# EAGLE design Launch_Tower_Ignition_Board_v6-4 (EAGLE 6.4)
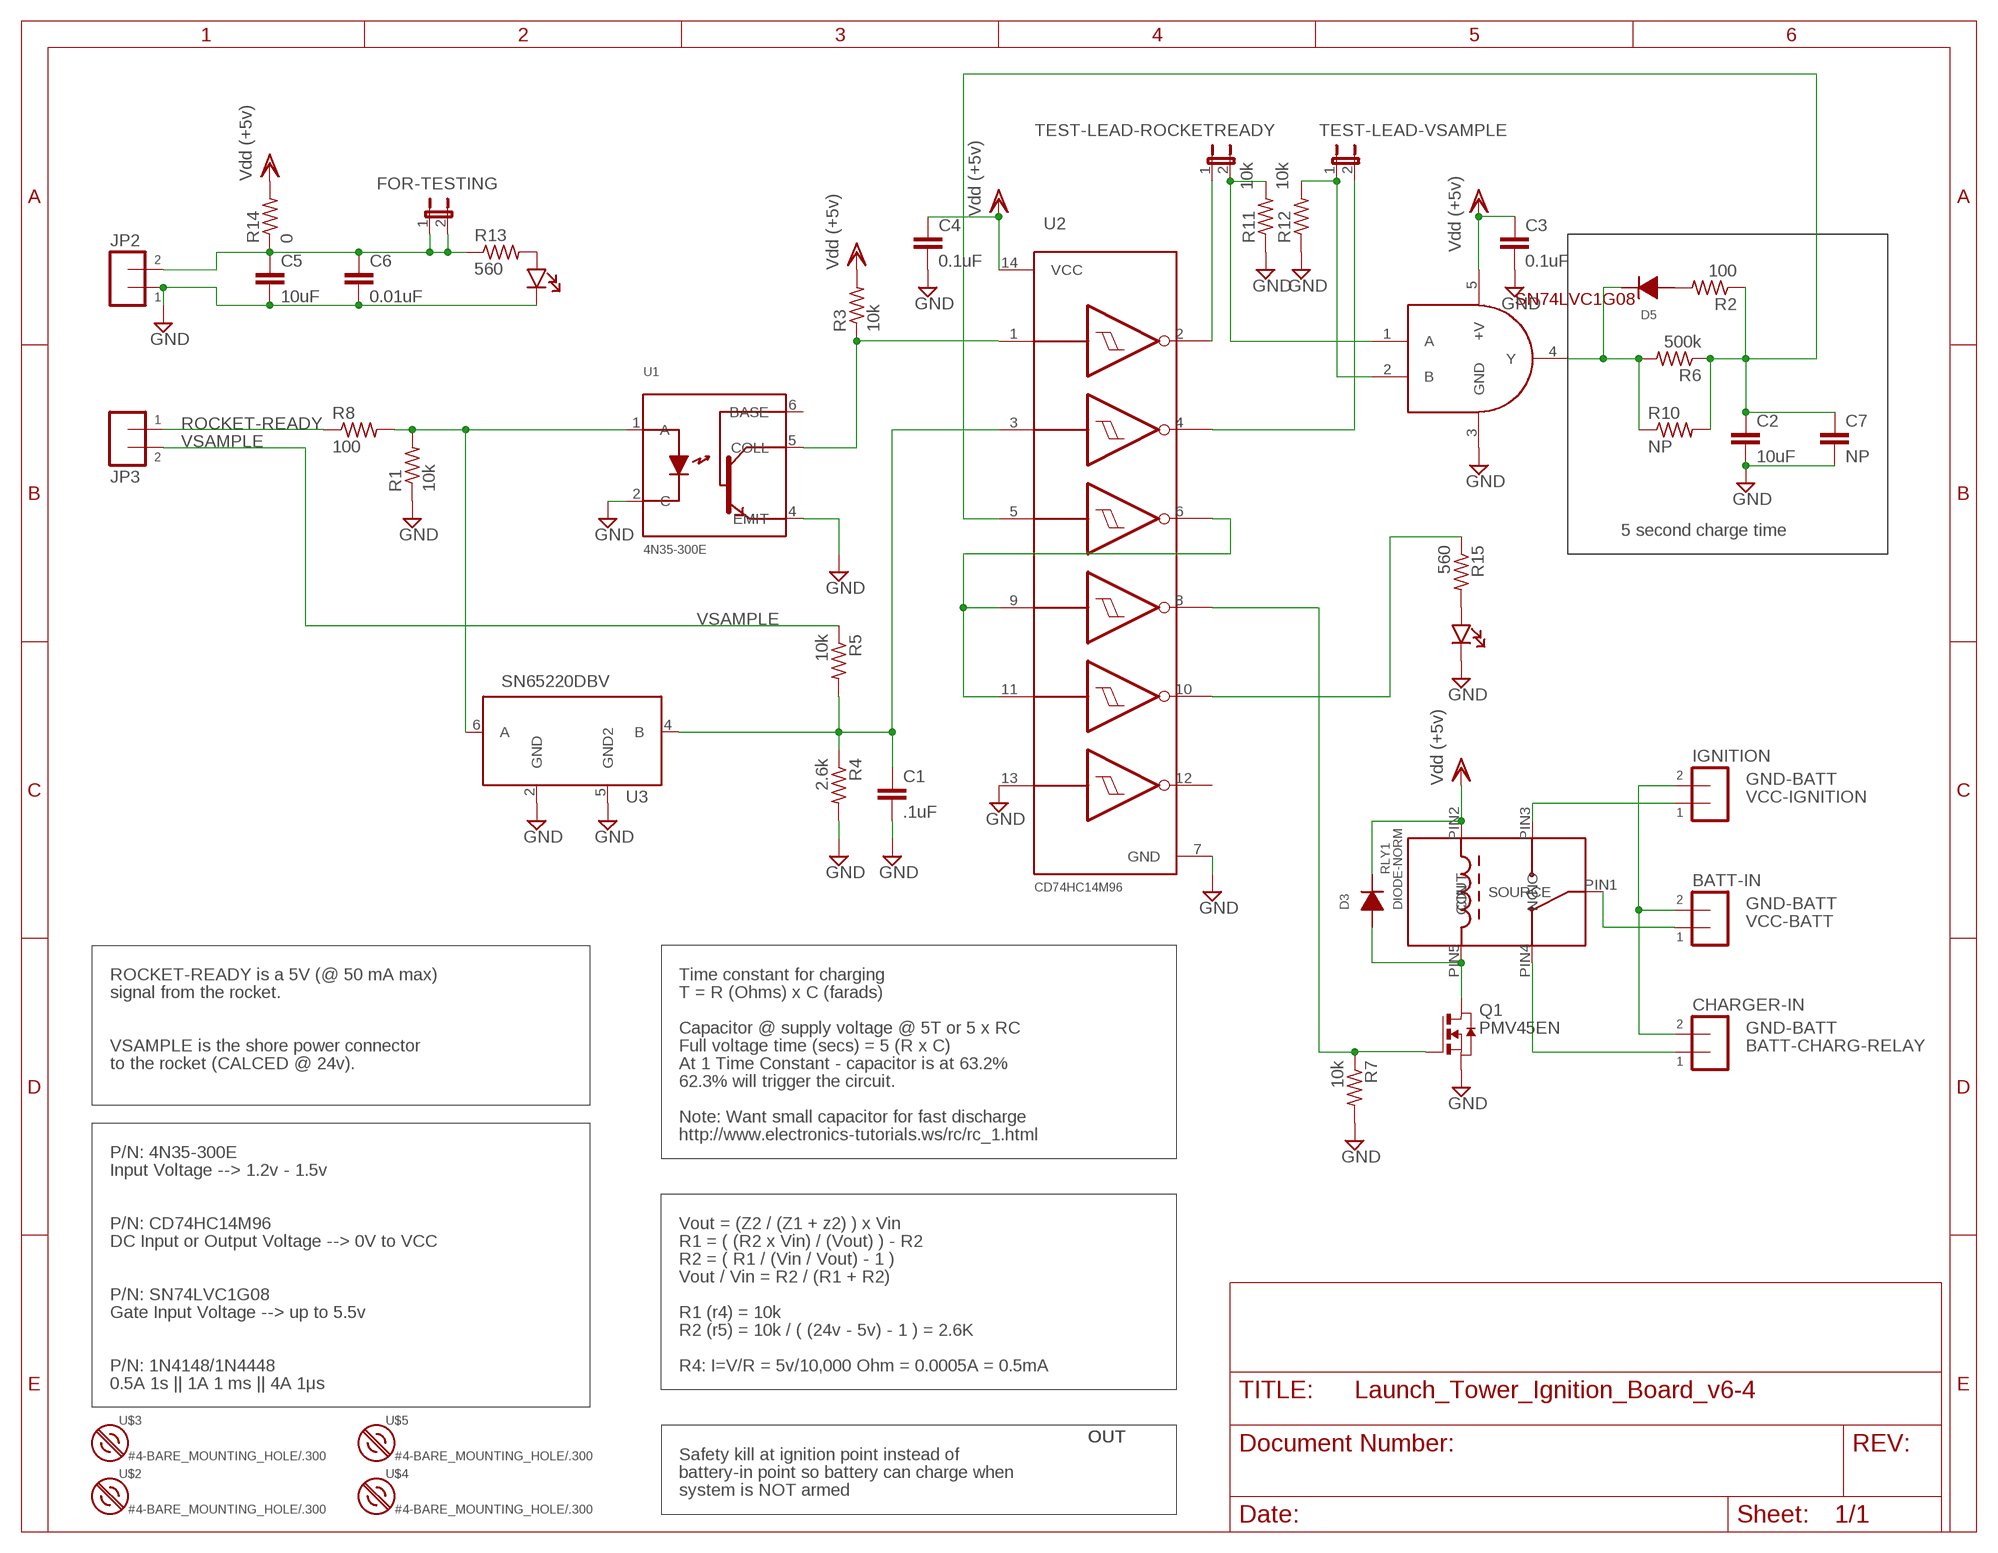
[diagram p0: schematic, sheet 1]

## Parts
BATT-IN  SCREW-TERMINAL-5MM  [SCREW-TERM-5MM]
C1  .1uF  C-EU0805-B  [0805-B]
C2  10uF  C-EU0805-B  [0805-B]
C3  0.1uF  C-EU0805-B  [0805-B]
C4  0.1uF  C-EU0805-B  [0805-B]
C5  10uF  C-EU0805-B  [0805-B]
C6  0.01uF  C-EU0805-B  [0805-B]
C7  NP  CAPPTH  [CAP-PTH-SMALL]
CHARGER-IN  SCREW-TERMINAL-5MM  [SCREW-TERM-5MM]
D3  DIODE-NORM  [DIODE]
D5  DIODE-NORM  [DIODE]
FOR-TESTING  JUMPER-2PTH  [1X02]
IGNITION  SCREW-TERMINAL-5MM  [SCREW-TERM-5MM]
JP2  SCREW-TERMINAL-5MM  [SCREW-TERM-5MM]
JP3  SCREW-TERMINAL-5MM  [SCREW-TERM-5MM]
LED-POWER-INDICATOR  LED-550-XX04  [LED-550]
LED-POWER-INDICATOR1  LED-550-XX04  [LED-550]
Q1  PMV45EN  [SOT23]
R1  10k  R-US_0805-B  [0805-B]
R2  100  R-US_0805-B  [0805-B]
R3  10k  R-US_0805-B  [0805-B]
R4  2.6k  R-US_0805-B  [0805-B]
R5  10k  R-US_0805-B  [0805-B]
R6  500k  R-US_0805-B  [0805-B]
R7  10k  R-US_0805-B  [0805-B]
R8  100  R-US_0805-B  [0805-B]
R10  NP  R-US_0207/10  [0207/10]
R11  10k  R-US_0805-B  [0805-B]
R12  10k  R-US_0805-B  [0805-B]
R13  560  R-US_0805-B  [0805-B]
R14  0  R-US_0805-B  [0805-B]
R15  560  R-US_0805-B  [0805-B]
RLY1  RELAY-2  [G5LA]
TEST-LEAD-ROCKETREADY  JUMPER-2PTH  [1X02]
TEST-LEAD-VSAMPLE  JUMPER-2PTH  [1X02]
U1  OPTOISOLATOR  [4N35-300E]
U2  INVERT GATES  HEX_INV_SHMITT_TRIG  [INVERTSOIC14]
U3  SN65220DBV  [SOT23-6L]
U4  AND GATE  SN74LVC1G08  [SOT23-5]
U$2  #4-BARE_MOUNTING_HOLE/.300  [#4/.300-BARE+STD_NUT_OR_STAR_WASHER]
U$3  #4-BARE_MOUNTING_HOLE/.300  [#4/.300-BARE+STD_NUT_OR_STAR_WASHER]
U$4  #4-BARE_MOUNTING_HOLE/.300  [#4/.300-BARE+STD_NUT_OR_STAR_WASHER]
U$5  #4-BARE_MOUNTING_HOLE/.300  [#4/.300-BARE+STD_NUT_OR_STAR_WASHER]

## Nets
BATT-CHARG-RELAY: CHARGER-IN.1 RLY1.PIN4(NC)
GND-BATT: BATT-IN.2 CHARGER-IN.2 IGNITION.2
N$1: R12.2 TEST-LEAD-VSAMPLE.1 U4.2(B)
N$2: LED-POWER-INDICATOR.ANODE R13.2
N$3: R3.1 U1.5(COLL) U2.1(1A)
N$4: JP3.1 R8.1
N$5: R11.2 TEST-LEAD-ROCKETREADY.2 U4.1(A)
N$6: TEST-LEAD-VSAMPLE.2 U2.4(2Y)
N$7: C1.1 R4.1 R5.2 U2.3(2A) U3.4(B)
N$8: D5.A R2.2
N$9: D3.A Q1.3(D) RLY1.PIN5(CIN)
N$10: Q1.1(G) R7.1 U2.8(4Y)
N$11: TEST-LEAD-ROCKETREADY.1 U2.2(1Y)
N$12: C5.1 C6.1 FOR-TESTING.1 FOR-TESTING.2 JP2.2 R13.1 R14.1
N$13: D5.C R6.2 R10.1 U4.4(Y)
N$14: R15.1 U2.10(5Y)
N$15: C2.1 C7.1 R2.1 R6.1 R10.2 U2.5(3A)
N$18: LED-POWER-INDICATOR1.ANODE R15.2
N-NOT2: U2.6(3Y) U2.9(4A) U2.11(5A)
NAME: C1.2 C2.2 C3.2 C4.2 C5.2 C6.2 C7.2 JP2.1 LED-POWER-INDICATOR1.CATHODE LED-POWER-INDICATOR.CATHODE Q1.2(S) R1.1 R4.2 R7.2 R11.1 R12.1 U1.2(C) U1.4(EMIT) U2.7(GND) U2.13(6A) U3.2(GND) U3.5(GND2) U4.3(GND) ; supply symbol labelled GND
ROCKET-READY: R1.2 R8.2 U1.1(A) U3.6(A)
VCC-BATT: BATT-IN.1 RLY1.PIN1(SOURCE)
VCC-IGNITION: IGNITION.1 RLY1.PIN3(NO)
VDD: C3.1 C4.1 D3.C R3.2 R14.2 RLY1.PIN2(COUT) U2.14(VCC) U4.5(+V) ; supply symbol labelled Vdd (+5v)
VSAMPLE: JP3.2 R5.1
Unconnected: U1.6(BASE) U2.12(6Y)

## Notes on the sheet
- 5 second charge time
- ROCKET-READY is a 5V (@ 50 mA max) | Time constant for charging
- signal from the rocket. | T = R (Ohms) x C (farads)
- Capacitor @ supply voltage @ 5T or 5 x RC
- VSAMPLE is the shore power connector | Full voltage time (secs) = 5 (R x C)
- to the rocket (CALCED @ 24v). | At 1 Time Constant - capacitor is at 63.2%
- 62.3% will trigger the circuit.
- Note: Want small capacitor for fast discharge
- http://www.electronics-tutorials.ws/rc/rc_1.html
- P/N: 4N35-300E
- Input Voltage --> 1.2v - 1.5v
- P/N: CD74HC14M96 | Vout = (Z2 / (Z1 + z2) ) x Vin
- DC Input or Output Voltage --> 0V to VCC | R1 = ( (R2 x Vin) / (Vout) ) - R2
- R2 = ( R1 / (Vin / Vout) - 1 )
- Vout / Vin = R2 / (R1 + R2)
- P/N: SN74LVC1G08
- Gate Input Voltage --> up to 5.5v | R1 (r4) = 10k
- R2 (r5) = 10k / ( (24v - 5v) - 1 ) = 2.6K
- P/N: 1N4148/1N4448 | R4: I=V/R = 5v/10,000 Ohm = 0.0005A = 0.5mA
- 0.5A 1s || 1A 1 ms || 4A 1μs
- OUT | OUT | OUT
- Safety kill at ignition point instead of
- battery-in point so battery can charge when
- system is NOT armed

## Library data of the parts
BATT-IN CHARGER-IN IGNITION JP2 JP3 = launch-tower:SCREW-TERMINAL-5MM
C1-C6 = rcl_custom:C-EU: CAPACITOR, European symbol
C7 = SparkFun:CAP: Capacitor Standard 0603 ceramic capacitor, and 0.1" leaded capacitor.
D3 D5 = launch-tower:DIODE-NORM
FOR-TESTING TEST-LEAD-ROCKETREADY TEST-LEAD-VSAMPLE = SparkFun:JUMPER-2: Jumper Basic 0.1" spaced jumper. Use with breakaway headers.
LED-POWER-INDICATOR LED-POWER-INDICATOR1 = launch-tower:LED-550-XX04
Q1 = Tova:PMV45EN
R1-R8 R10-R15 = rcl_custom:R-US_: RESISTOR, American symbol
RLY1 = launch-tower:RELAY-2
U1 = launch-tower:OPTOISOLATOR
U2 = launch-tower:HEX_INV_SHMITT_TRIG: Single Schmitt-Trigger Inverter Gate
U3 = sn65220:SN65220
U4 = SparkFun:SN74LVC1G08
U$2-U$5 = mount:#4-BARE_MOUNTING_HOLE: 1/8" drill hole for #4 screw mount

## Board
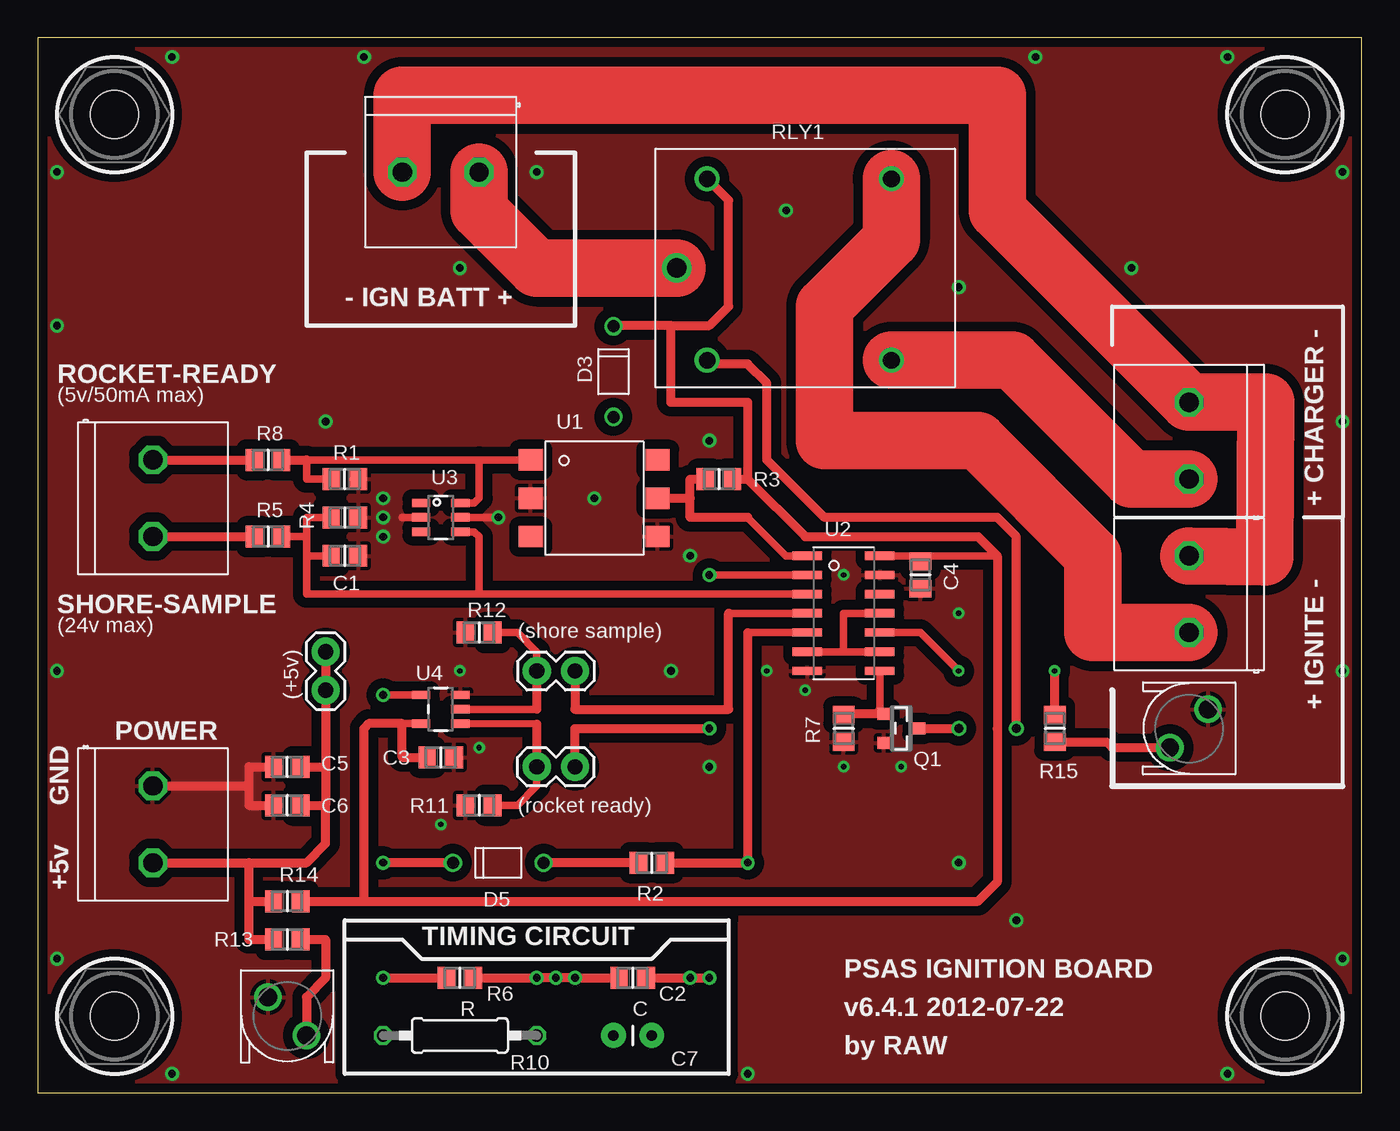
[diagram p1: board, top side]
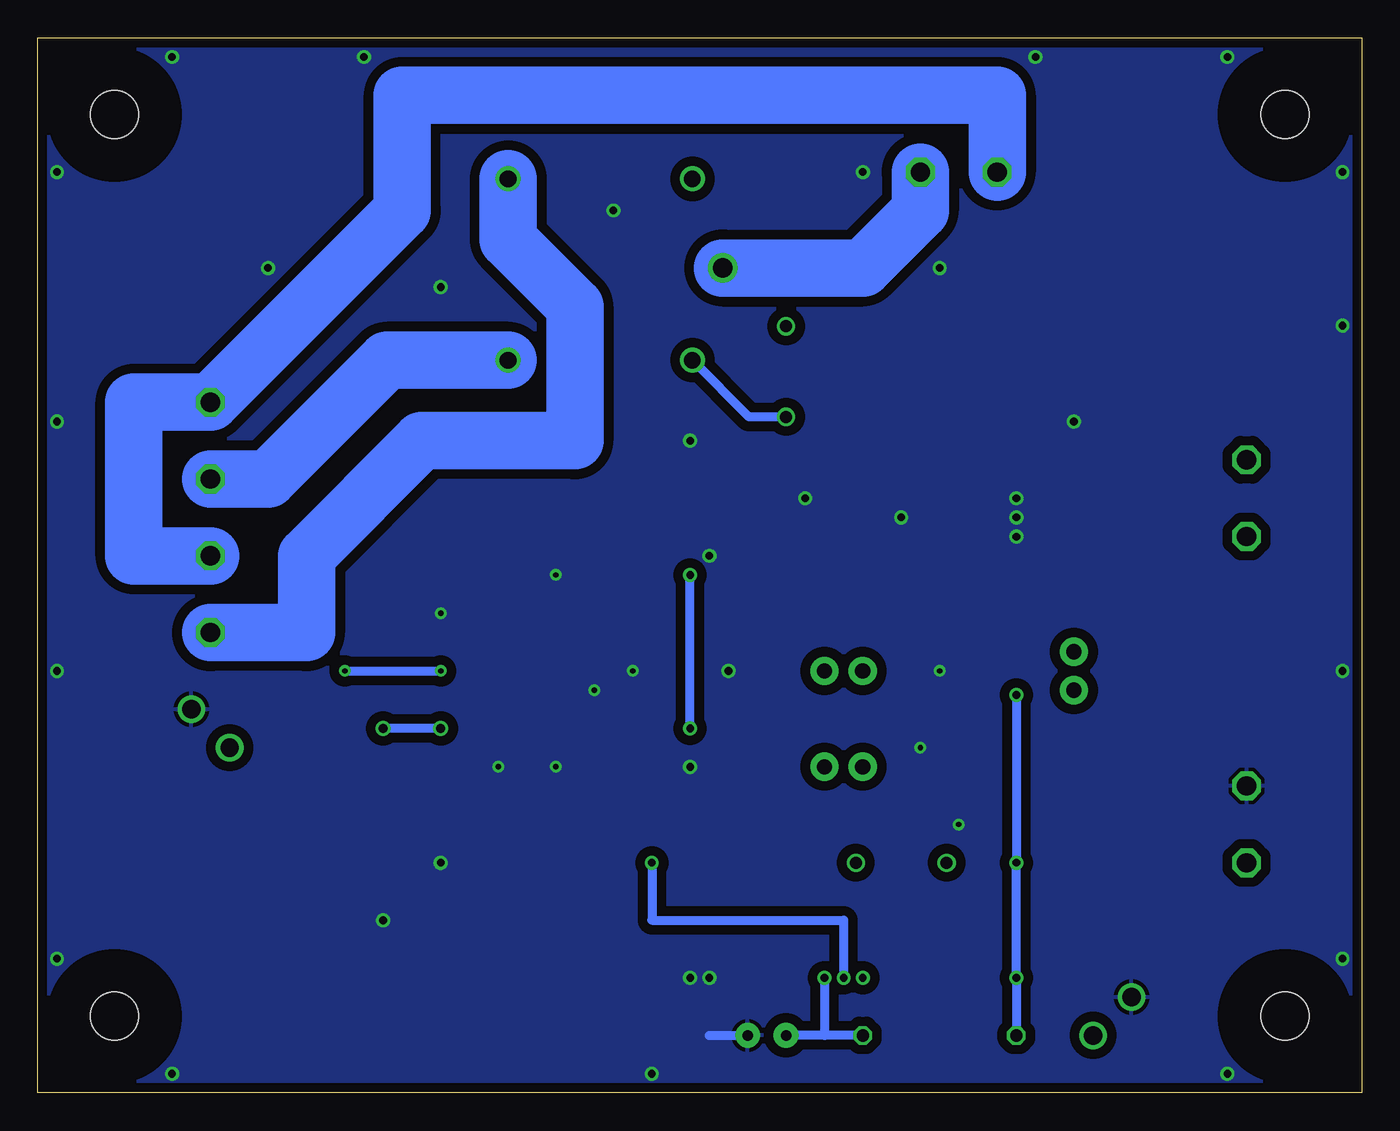
[diagram p2: board, bottom side, seen from below]

Size 87.63 x 69.85 mm. Coordinates in mm from the lower left corner, seen from the top.
Outline: 0,0 87.63,0 87.63,69.85 0,69.85 0,0
Copper layers (1*16): Top 0.0178mm / dielectric 59mil / Bottom 0.0178mm
Design rules "default": minimum track width 6mil, minimum drill 14mil, track to track 6mil, track to pad 6mil, pad to pad 6mil, via to via 6mil, smd to smd 6mil, copper to edge 20mil, drill to drill 16mil, minimum pad ring 8mil, minimum via ring 8mil, stop-mask expansion 3mil, vias tented up to drill 0mil, thermal gap 10mil
tRestrict: area 20.3,1.3 to 45.7,11.4

### Footprints (pad centres in the part's own frame; a part is rotated, then mirrored left to right if it is on the bottom)
SCREW-TERM-5MM = drill 1.27 octagon: 1 -2.54,0; 2 2.54,0
0805-B = smd 1.15 x 1.45: 1 -0.9,0; 2 0.9,0
CAP-PTH-SMALL = drill 0.7 pad 1.651: 1 0,0; 2 2.54,0
DIODE = drill 0.8: A 3,0; C -3,0
1X02 = drill 1.016 pad 1.88: 1 0,0; 2 2.54,0
LED-550 = drill 1.22: ANODE 1.27,-1.27; CATHODE -1.27,1.27
SOT23 = smd 0.787 x 0.889: 1 -0.953,-1.143; 2 0.953,-1.143; 3 0,1.143
0207/10 = drill 0.813 octagon: 1 -5.08,0; 2 5.08,0
G5LA = drill 1.3: PIN1 -8.5,0 | drill 1.1: PIN2 -6.5,5.9; PIN3 5.7,5.9; PIN4 5.7,-6.1; PIN5 -6.5,-6.1
4N35-300E = smd 1.4 x 1.6: 1 -2.54,-4.2; 2 0,-4.2; 3 2.54,-4.2; 4 2.54,4.2; 5 0,4.2; 6 -2.54,4.2
INVERTSOIC14 = smd 0.55 x 1.95: 1 -3.81,-2.4; 2 -2.54,-2.4; 3 -1.27,-2.4; 4 0,-2.4; 5 1.27,-2.4; 6 2.54,-2.4; 7 3.81,-2.4; 8 3.81,2.4; 9 2.54,2.4; 10 1.27,2.4; 11 0,2.4; 12 -1.27,2.4; 13 -2.54,2.4; 14 -3.81,2.4
SOT23-6L = smd 0.55 x 1.2: 1 -0.95,-1.3; 2 0,-1.3; 3 0.95,-1.3; 4 0.95,1.3; 5 0,1.3; 6 -0.95,1.3
SOT23-5 = smd 0.55 x 1.2: 1 -0.95,-1.3; 2 0,-1.3; 3 0.95,-1.3; 4 0.95,1.3; 5 -0.95,1.3
#4/.300-BARE+STD_NUT_OR_STAR_WASHER = hole 3.175: 0,0

### Placement (x,y rotation side)
BATT-IN  26.67,60.96 180 top
C1  20.32,35.56 0 top
C2  39.37,7.62 0 top
C3  26.67,22.23 0 top
C4  58.42,34.29 270 top
C5  16.51,21.59 180 top
C6  16.51,19.05 180 top
C7  38.1,3.81 0 top
CHARGER-IN  76.2,43.18 90 top
D3  38.1,47.75 270 top
D5  30.48,15.24 0 top
FOR-TESTING  19.05,26.67 90 top
IGNITION  76.2,33.02 90 top
JP2  7.62,17.78 270 top
JP3  7.62,39.37 270 top
LED-POWER-INDICATOR  16.51,5.08 0 top
LED-POWER-INDICATOR1  76.2,24.13 270 top
Q1  57.15,24.13 270 top
R1  20.32,40.64 180 top
R2  40.64,15.24 180 top
R3  45.09,40.64 0 top
R4  20.32,38.1 0 top
R5  15.24,36.83 0 top
R6  27.94,7.62 180 top
R7  53.34,24.13 270 top
R8  15.24,41.91 0 top
R10  27.94,3.81 0 top
R11  29.21,19.05 0 top
R12  29.21,30.48 0 top
R13  16.51,10.16 0 top
R14  16.51,12.7 0 top
R15  67.31,24.13 270 top
RLY1  50.8,54.61 0 top
TEST-LEAD-ROCKETREADY  35.56,21.59 180 top
TEST-LEAD-VSAMPLE  33.02,27.94 0 top
U1  36.83,39.37 270 top
U2  53.34,31.75 270 top
U3  26.67,38.1 270 top
U4  26.67,25.4 90 top
U$2  5.08,64.77 0 top
U$3  82.55,64.77 0 top
U$4  82.55,5.08 0 top
U$5  5.08,5.08 0 top

### Tracks (layer width: path | path; a pad name or v marks a point on that pad's centre or on a via)
BATT-CHARG-RELAY
  Top 3.81: CHARGER-IN.1 72.39,40.64 64.52,48.51 RLY1.PIN4
  Bottom 3.81: RLY1.PIN4 64.52,48.51 72.39,40.64 CHARGER-IN.1
GND-BATT
  Top 3.81: BATT-IN.2 24.13,66.04 63.5,66.04 63.5,58.42 CHARGER-IN.2 81.28,45.72 81.2,35.48 IGNITION.2
  Bottom 3.81: IGNITION.2 81.28,35.56 81.28,45.72 CHARGER-IN.2 63.5,58.42 63.5,66.04 24.13,66.04 BATT-IN.2
N$1
  Top 0.508: 33.02,25.4 U4.2 | R12.2 31.75,30.48 33.02,29.21 TEST-LEAD-VSAMPLE.1
  Top 0.61: TEST-LEAD-VSAMPLE.1 33.02,25.4
N$2
  Top 0.61: R13.2 19.05,10.16 19.05,7.62 17.78,6.35 LED-POWER-INDICATOR.ANODE
N$3
  Top 0.508: U2.1 49.53,35.56 46.99,38.1
  Top 0.61: U1.5 43.18,39.37 | 46.99,38.1 43.18,38.1 43.18,39.37 | 43.18,39.37 43.18,40.64 R3.1
N$4
  Top 0.61: JP3.1 R8.1
N$5
  Top 0.508: U4.1 33.02,24.43 | R11.2 31.75,19.05 33.02,20.32 TEST-LEAD-ROCKETREADY.2
  Top 0.61: 33.02,24.43 33.02,24.42 33.02,22.86 TEST-LEAD-ROCKETREADY.2
N$6
  Top 0.508: 45.72,31.75 U2.4
  Top 0.61: 45.72,31.75 45.72,25.4 35.56,25.4 TEST-LEAD-VSAMPLE.2
N$7
  Top 0.508: 17.78,35.56 17.78,33.02 29.21,33.02 | 17.78,35.56 17.78,36.83 | 29.21,33.02 U2.3 | U3.4 28.89,37.15 29.21,36.83 29.21,33.02 | R5.2 17.78,36.83 | R4.1 17.78,38.1 17.78,36.83 | C1.1 17.78,35.56
N$8
  Top 0.61: R2.2 D5.A
N$9  (via drill 0.6)
  Top 0.61: Q1.3 v60.96,24.13 | v64.77,24.13 64.77,36.83 63.5,38.1 52.07,38.1 48.26,41.91 48.26,46.99 46.99,48.26 44.55,48.26 RLY1.PIN5
  Bottom 0.61: D3.A 40.54,44.75 RLY1.PIN5 | v60.96,24.13 v64.77,24.13
N$10
  Top 0.508: U2.8 55.74,25.35
  Top 0.61: R7.1 53.39,25.08 Q1.1 55.74,25.35
N$11  (via drill 0.51)
  Top 0.508: v44.45,34.29 U2.2
  Top 0.61: v44.45,24.13 35.56,24.13 TEST-LEAD-ROCKETREADY.1
  Bottom 0.61: v44.45,24.13 v44.45,34.29
N$12
  Top 0.61: 19.05,21.59 19.05,19.05 | 13.97,15.24 13.97,12.7 | 13.97,12.7 13.97,10.16 R13.1 | FOR-TESTING.2 FOR-TESTING.1 19.05,21.59 | C5.1 19.05,21.59 | C6.1 19.05,19.05 | 13.97,12.7 R14.1 | JP2.2 13.97,15.24 | 13.97,15.24 17.78,15.24 19.05,16.51 19.05,19.05
N$13  (via drill 0.51)
  Top 0.508: U4.4 v22.86,26.35
  Top 0.61: D5.C v22.86,15.24 | v22.86,7.62 R6.2
  Bottom 0.61: v22.86,26.35 v22.86,15.24 v22.86,7.62 R10.1
N$14  (via drill 0.36)
  Top 0.508: v60.96,27.94 58.42,30.48 U2.10
  Top 0.584: R15.1 v67.31,27.94
  Bottom 0.61: v67.31,27.94 v60.96,27.94
N$15  (via drill 0.51)
  Top 0.508: U2.5 46.99,30.48
  Top 0.61: 46.99,30.48 v46.99,15.24 R2.1 | R6.1 v33.02,7.62 v34.29,7.62 v35.56,7.62 C2.1
  Bottom 0.61: v35.56,7.62 35.56,3.81 C7.1 R10.2 | v46.99,15.24 46.99,11.43 34.29,11.43 v34.29,7.62
N$18
  Top 0.584: R15.2 70.75,23.23 71.12,22.86 LED-POWER-INDICATOR1.ANODE
N-NOT2
  Top 0.508: U2.6 53.34,29.21 | 53.34,29.21 U2.9 | U2.11 53.34,31.75 53.34,29.21
NAME  (via drill 0.36, 0.51)
  Top 0.508: U3.2 24.13,38.1 | U3.5 v30.48,38.1
  Top 0.61: 13.97,20.32 13.97,21.59 C5.2 | 13.97,20.32 13.97,19.05 C6.2 | JP2.1 13.97,20.32 | v44.45,7.62 v43.18,7.62 C2.2
  Bottom 0.61: 43.18,3.81 C7.2
  other vias: 8.89,1.27 78.74,68.58 86.36,60.96 78.74,1.27 72.39,54.61 86.36,27.94 86.36,44.45 86.36,8.89 8.89,68.58 66.04,68.58 21.59,68.58 1.27,60.96 43.18,35.56 22.86,39.37 22.86,38.1 22.86,36.83 60.96,31.75 53.34,34.29 50.8,26.67 48.26,27.94 53.34,21.59 57.15,21.59 27.94,27.94 29.21,22.86 26.67,17.78 60.96,53.34 49.53,58.42 33.02,60.96 44.45,43.18 36.83,39.37 1.27,8.89 1.27,27.94 1.27,50.8 27.94,54.61 41.91,27.94 44.45,21.59 60.96,15.24 64.77,11.43 46.99,1.27 19.05,44.45
  pour Top (isolate 0.635): 0,69.85 87.63,69.85 87.63,0 0,0
  pour Bottom (isolate 0.635): 0,69.85 87.63,69.85 87.63,0 0,0
ROCKET-READY
  Top 0.508: 29.21,41.91 17.78,41.91 17.78,40.64 R1.2 | 29.21,41.91 U1.1 | U3.6 28.89,39.05 29.21,39.37 29.21,41.91
  Top 0.61: R8.2 17.78,41.91
VCC-BATT
  Top 3.81: BATT-IN.1 29.21,58.42 33.02,54.61 RLY1.PIN1
  Bottom 3.81: BATT-IN.1 29.21,58.42 33.02,54.61 RLY1.PIN1
VCC-IGNITION
  Top 3.81: IGNITION.1 69.85,30.48 69.85,35.56 62.23,43.18 52.07,43.18 52.07,52.07 56.5,56.5 RLY1.PIN3
  Bottom 3.81: RLY1.PIN3 56.5,56.5 52.07,52.07 52.07,43.18 62.23,43.18 69.85,35.56 69.85,30.48 IGNITION.1
VDD
  Top 0.254: 63.5,23.32 63.5,24.13
  Top 0.508: U4.5 24.13,24.45 | U2.14 58.42,35.56 | 58.42,35.56 63.5,35.56 | C4.1 58.42,35.56
  Top 0.61: 21.59,12.7 21.59,24.13 21.91,24.45 24.13,24.45 24.13,22.23 C3.1 | 21.59,12.7 62.23,12.7 63.5,13.97 63.5,24.13 63.5,35.56 62.23,36.83 50.8,36.83 46.99,40.64 | 41.91,50.8 41.91,45.72 46.99,45.72 46.99,40.64 | 41.91,50.8 44.45,50.8 45.72,52.07 45.72,59.09 RLY1.PIN2 | R3.2 46.99,40.64 | R14.2 21.59,12.7 | 41.91,50.8 38.15,50.8 D3.C
VSAMPLE
  Top 0.61: JP3.2 R5.1

### Text on the board
tPlace: - IGN BATT + | ROCKET-READY | (5v/50mA max) | + CHARGER - | SHORE-SAMPLE | (24v max) | (shore sample) | (+5v) | + IGNITE - | POWER | GND | (rocket ready) | +5v | TIMING CIRCUIT | PSAS IGNITION BOARD | R | C | v6.4.1 2012-07-22 | by RAW